# Altium schematic sheet supply.SchDoc
size A4; SheetNumber: 9; SheetTotal: 12; SPICEModelCacheMDRHNIGR: <root> / <DocumentId>MDRHNIGR</DocumentId> / <CacheFrame Number="0"> / <Model Name="led0" Kind="MDL"> / <Text>*Typ INFRARED GaAs LED: Vf=1.2V Vr=5V If=40mA trr=3uS / *LED Pinout: 1=A, 2=K / .MODEL LED0 D (IS=93.5P RS=84M N=2.63 BV=5 IBV=10U / + CJO=2.97P VJ=.75 M=.333 TT=4.32U)</Text> / </Model> / <Model Name="1n4002" Kind="MDL"> / <Text>*1N4002 MCE 8-16-95 / *100V 1A Si GenPurpose Diode pkg:DIODE0.4 1,2 / .MODEL 1N4002 D(IS=2.55E-9 RS=0.042 N=1.75 TT=5.76E-6 CJO=1.85E-11 / + VJ=0.75 M=0.333 BV=100 IBV=1E-5 )</Text> / </Model> / </CacheFrame> / </root>
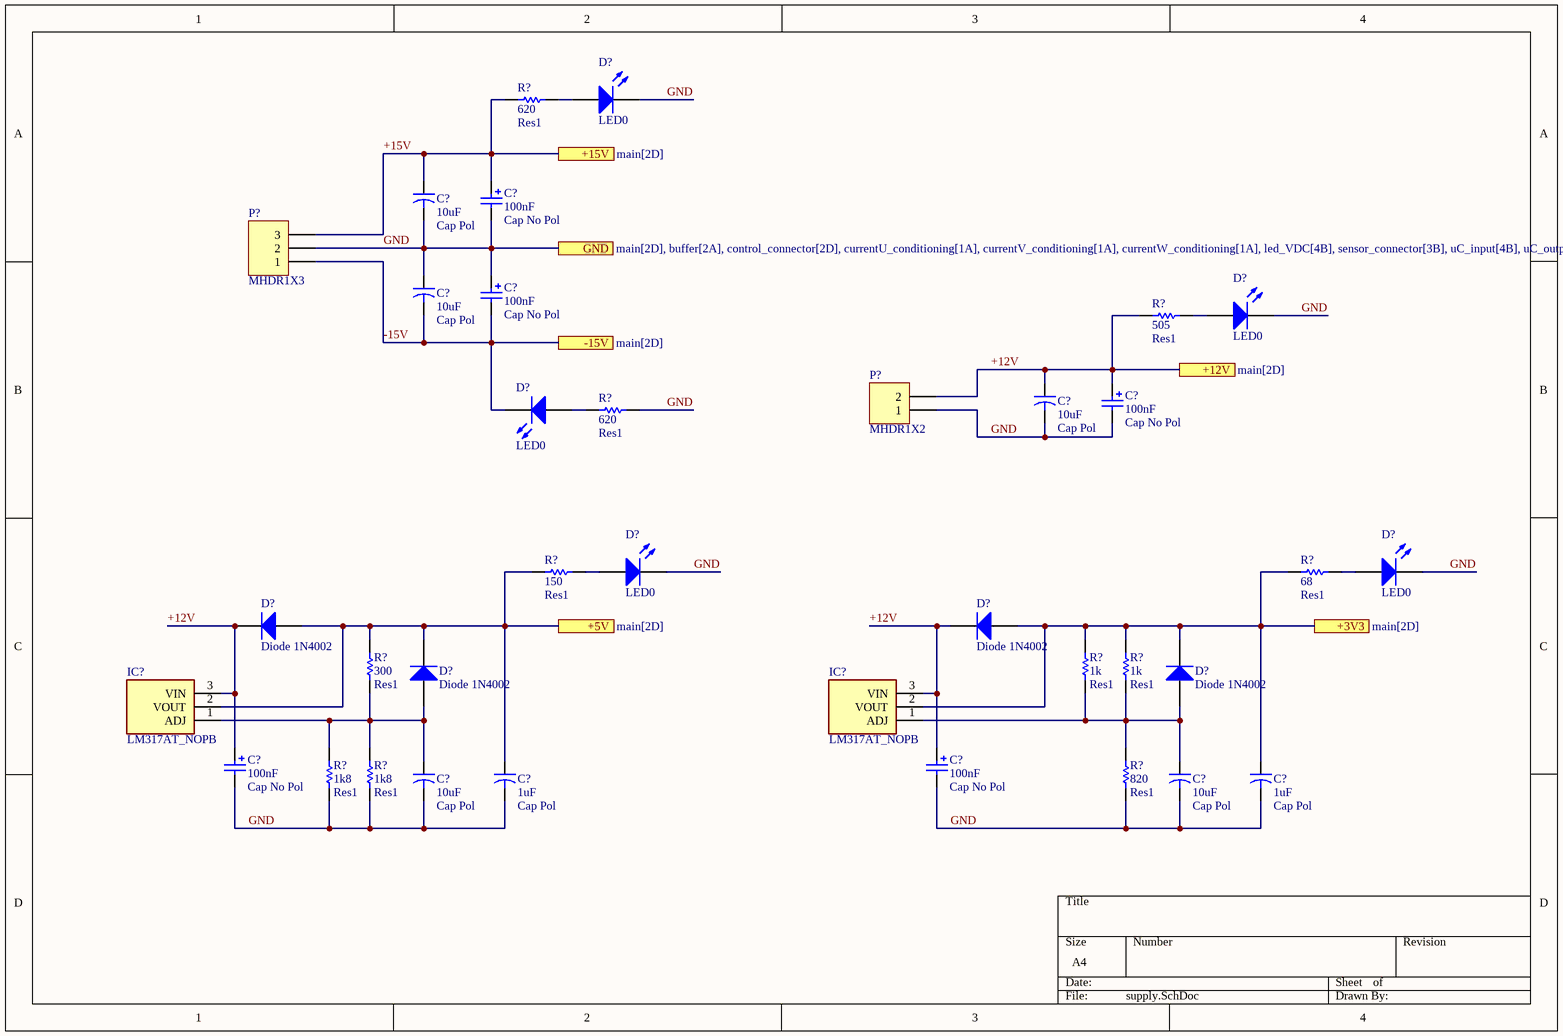
[diagram p0: supply.SchDoc]

## Parts
(Parts that share a designator on the sheet are numbered #1, #2 ... from top to bottom, then left to right.)
C?#1  Cap Pol  value 10uF  [CAPR5-4X5]
C?#2  Cap No Pol  value 100nF  [RAD-0.1]
C?#3  Cap Pol  value 10uF  [CAPR5-4X5]
C?#4  Cap No Pol  value 100nF  [RAD-0.1]
C?#5  Cap Pol  value 10uF  [CAPR5-4X5]
C?#6  Cap No Pol  value 100nF  [RAD-0.1]
C?#7  Cap No Pol  value 100nF  [RAD-0.1]
C?#8  Cap No Pol  value 100nF  [RAD-0.1]
C?#9  Cap Pol  value 10uF  [CAPR5-4X5]
C?#10  Cap Pol  value 1uF  [CAPR5-4X5]
C?#11  Cap Pol  value 10uF  [CAPR5-4X5]
C?#12  Cap Pol  value 1uF  [CAPR5-4X5]
D?#1  LED0  [LED-0]
D?#2  LED0  [LED-0]
D?#3  LED0  [LED-0]
D?#4  LED0  [LED-0]
D?#5  LED0  [LED-0]
D?#6  Diode 1N4002  [DO-41]
D?#7  Diode 1N4002  [DO-41]
D?#8  Diode 1N4002  [DO-41]
D?#9  Diode 1N4002  [DO-41]
IC?#1  LM317AT_NOPB  [TO254P470X1028X1955-3P]
IC?#2  LM317AT_NOPB  [TO254P470X1028X1955-3P]
P?#1  MHDR1X3  [MHDR1X3]
P?#2  MHDR1X2  [MHDR1X2]
R?#1  Res1  value 620  [AXIAL-0.3]
R?#2  Res1  value 505  [AXIAL-0.3]
R?#3  Res1  value 620  [AXIAL-0.3]
R?#4  Res1  value 150  [AXIAL-0.3]
R?#5  Res1  value 68  [AXIAL-0.3]
R?#6  Res1  value 300  [AXIAL-0.3]
R?#7  Res1  value 1k  [AXIAL-0.3]
R?#8  Res1  value 1k  [AXIAL-0.3]
R?#9  Res1  value 1k8  [AXIAL-0.3]
R?#10  Res1  value 1k8  [AXIAL-0.3]
R?#11  Res1  value 820  [AXIAL-0.3]

## Ports
+3V3 (see main[2D]), +5V (see main[2D]), +12V (see main[2D]), +15V (see main[2D]), -15V (see main[2D]), GND (see main[2D], buffer[2A], control_connector[2D], currentU_conditioning[1A], currentV_conditioning[1A], currentW_conditioning[1A], led_VDC[4B], sensor_connector[3B], uC_input[4B], uC_output[4B], voltage_conditioning[3A])

## Nets
+3V3: C?#12.1 D?#7.1(A) D?#9.2(K) IC?#2.2(VOUT) R?#5.1 R?#7.1 R?#8.1 ; port +3V3
+5V: C?#10.1 D?#6.1(A) D?#8.2(K) IC?#1.2(VOUT) R?#4.1 R?#6.1 ; port +5V
+12V: C?#5.1 C?#6.1 C?#7.1 C?#8.1 D?#6.2(K) D?#7.2(K) IC?#1.3(VIN) IC?#2.3(VIN) P?#2.2 R?#2.1 ; port +12V
+15V: C?#1.1 C?#2.1 P?#1.3 R?#1.1 ; port +15V
-15V: C?#3.2 C?#4.2 D?#3.2(K) P?#1.1 ; port -15V
GND: C?#2.2 C?#3.1 C?#4.1 C?#5.2 C?#6.2 C?#7.2 C?#8.2 C?#9.2 C?#10.2 C?#11.2 C?#12.2 D?#1.2(K) D?#2.2(K) D?#4.2(K) D?#5.2(K) P?#1.2 P?#2.1 R?#3.1 R?#9.2 R?#10.2 R?#11.2 ; port GND
NetC?#9_1: C?#9.1 D?#8.1(A) IC?#1.1(ADJ) R?#6.2 R?#9.1 R?#10.1
NetC?#11_1: C?#11.1 D?#9.1(A) IC?#2.1(ADJ) R?#7.2 R?#8.2 R?#11.1
NetD?#1_1: D?#1.1(A) R?#1.2
NetD?#2_1: D?#2.1(A) R?#2.2
NetD?#3_1: D?#3.1(A) R?#3.2
NetD?#4_1: D?#4.1(A) R?#4.2
NetD?#5_1: D?#5.1(A) R?#5.2

Not connected (* = marked no-connect by the designer): C?#1 2

## Library data of the parts
C?#1 C?#3 C?#5 C?#9-C?#12 = Cap Pol: Capacitor; Published: 23-Sep-2002; PackageReference: CAPR5-4X5; Publisher: Altium Limited; PackageDescription: Capacitor; 2 Leads
C?#2 C?#4 C?#6-C?#8 = Cap No Pol: Polarized Capacitor (Radial); Published: 8-Jun-2000; LatestRevisionDate: 17-Jul-2002; LatestRevisionNote: Re-released for DXP Platform.; PackageReference: RB7.6-15; Publisher: Altium Limited; PackageDescription: Polarized Capacitor (Radial); 2 Leads
D?#1-D?#5 = LED0: Typical INFRARED GaAs LED; Published: 8-Jun-2000; LatestRevisionDate: 08-Jul-2005; LatestRevisionNote: Mech Layer 1 removed.; PackageReference: LED-0; Publisher: Altium Limited; PackageDescription: LED; 2 Leads
D?#6-D?#9 = Diode 1N4002: 1 Amp General Purpose Rectifier; Published: 8-Jun-2000; LatestRevisionDate: 17-Jul-2002; LatestRevisionNote: Re-released for DXP Platform.; DatasheetVersion: 1998; PackageVersion: Aug-1999; PackageReference: DO-41; Publisher: Altium Limited; PackageDescription: Diode, Axial; Body 5.2 x 2.7 mm (LxDia. max), Lead Dia. 0.86 mm (max); Code_JEDEC: DO-204-AL; ComponentLink1Description: Manufacturer Link; ComponentLink1URL: http://www.fairchildsemi.com/; ComponentLink2Description: Datasheet; ComponentLink2URL: http://www.fairchildsemi.com/ds/1N%2F1N4001.pdf
IC?#1 IC?#2 = LM317AT_NOPB: Integrated Circuit; Manufacturer_Name: Texas Instruments; Manufacturer_Part_Number: LM317AT/NOPB; Datasheet Link: http://www.ti.com/lit/gpn/lm317a; Height: 4.7mm; Mouser Part Number: 926-LM317AT/NOPB; Mouser Price/Stock: https://www.mouser.co.uk/ProductDetail/Texas-Instruments/LM317AT-NOPB?qs=X1J7HmVL2ZFYFJRcNgsWcQ%3D%3D; Arrow Part Number: LM317AT/NOPB; Arrow Price/Stock: https://www.arrow.com/en/products/lm317atnopb/texas-instruments?region=nac
P?#1 = MHDR1X3: Header, 3-Pin; LatestRevisionDate: 17-Jul-2002; LatestRevisionNote: Re-released for DXP Platform.; Publisher: Altium Limited
P?#2 = MHDR1X2: Header, 2-Pin; LatestRevisionDate: 17-Jul-2002; LatestRevisionNote: Re-released for DXP Platform.; Publisher: Altium Limited
R?#1-R?#11 = Res1: Resistor; Published: 8-Jun-2000; LatestRevisionDate: 17-Jul-2002; LatestRevisionNote: Re-released for DXP Platform.; PackageReference: AXIAL-0.3; Publisher: Altium Limited; PackageDescription: Axial Device, Thru-Hole; 2 Leads; 0.3 in Pin Spacing